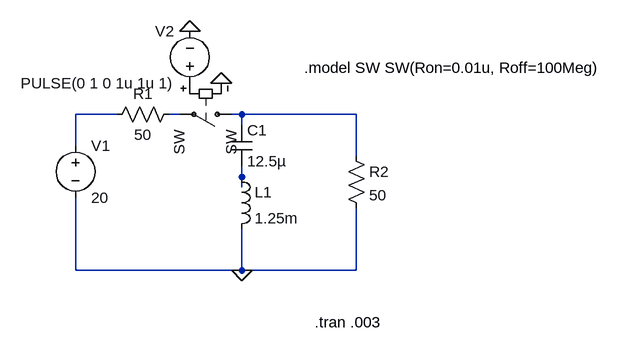
[diagram p0: schematic pas74.asc]
pas74.asc, the LTspice schematic file:
Version 4.1
SHEET 1 896 680
WIRE 112 80 48 80
WIRE 208 80 192 80
WIRE 304 80 288 80
WIRE 480 80 304 80
WIRE 304 96 304 80
WIRE 48 128 48 80
WIRE 480 144 480 80
WIRE 304 176 304 160
WIRE 304 192 304 176
WIRE 48 320 48 208
WIRE 304 320 304 256
WIRE 304 320 48 320
WIRE 480 320 480 224
WIRE 480 320 304 320
FLAG 272 32 0
FLAG 224 -48 0
FLAG 304 320 0
SYMBOL voltage 48 112 R0
SYMATTR InstName V1
SYMATTR Value 20
SYMBOL res 208 64 R90
WINDOW 0 0 56 VBottom 2
WINDOW 3 32 56 VTop 2
SYMATTR InstName R1
SYMATTR Value 50
SYMBOL ind 288 160 R0
SYMATTR InstName L1
SYMATTR Value 1.25m
SYMBOL cap 288 96 R0
SYMATTR InstName C1
SYMATTR Value 12.5µ
SYMBOL res 464 128 R0
SYMATTR InstName R2
SYMATTR Value 50
SYMBOL sw 304 80 R90
SYMATTR InstName SW
SYMBOL voltage 224 48 R180
WINDOW 0 24 96 Left 2
WINDOW 3 24 16 Left 2
WINDOW 123 0 0 Left 0
WINDOW 39 0 0 Left 0
SYMATTR InstName V2
SYMATTR Value PULSE(0 1 0 1u 1u 1)
TEXT 400 8 Left 2 !.model SW SW(Ron=0.01u, Roff=100Meg)
TEXT 416 400 Left 2 !.tran .003

The netlist it stands for:
* pas74.asc
V1 N001 0 20
R1 N002 N001 50
L1 N004 0 1.25m
C1 N003 N004 12.5µ
R2 N003 0 50
SW N003 N002 P001 0 SW
V2 P001 0 PULSE(0 1 0 1u 1u 1)
.model SW SW(Ron=0.01u, Roff=100Meg)
.tran .003
.backanno
.end